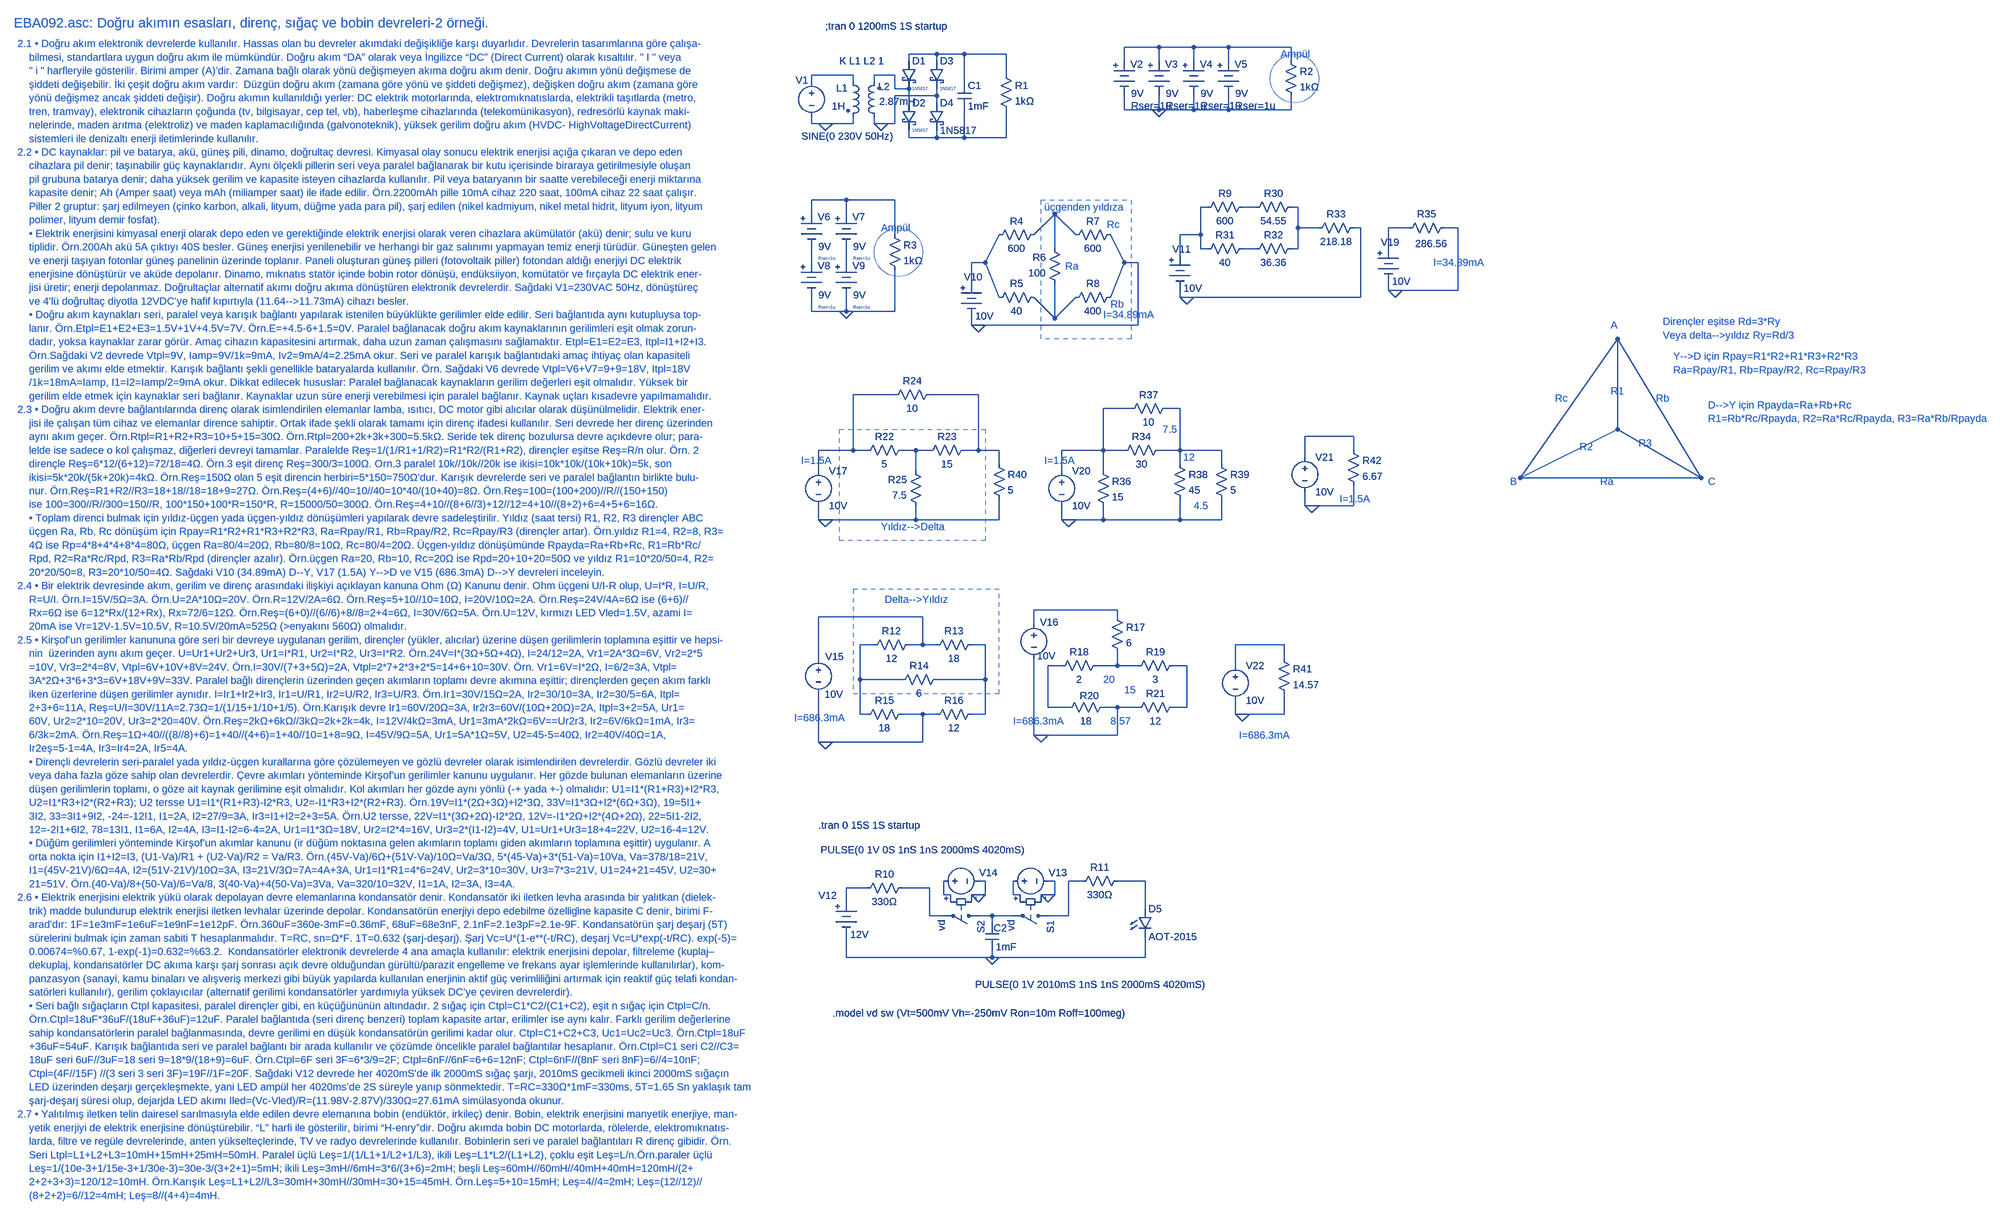
[diagram p0: schematic EBA092.asc]
EBA092.asc, the LTspice schematic file:
Version 4
SHEET 1 5628 4108
WIRE 2768 96 2688 96
WIRE 2848 96 2768 96
WIRE 2928 96 2848 96
WIRE 3072 96 2928 96
WIRE 2256 112 2192 112
WIRE 2320 112 2256 112
WIRE 2416 112 2320 112
WIRE 2192 128 2192 112
WIRE 2256 128 2256 112
WIRE 2688 128 2688 96
WIRE 2768 128 2768 96
WIRE 2848 128 2848 96
WIRE 2928 128 2928 96
WIRE 3072 128 3072 96
WIRE 2064 160 1968 160
WIRE 2160 160 2112 160
WIRE 2416 160 2416 112
WIRE 1968 176 1968 160
WIRE 2064 176 2064 160
WIRE 2112 176 2112 160
WIRE 2320 176 2320 112
WIRE 2160 192 2160 160
WIRE 2192 192 2160 192
WIRE 2256 208 2256 192
WIRE 2256 208 2160 208
WIRE 2192 224 2192 192
WIRE 2256 224 2256 208
WIRE 2688 240 2688 208
WIRE 2768 240 2768 208
WIRE 2768 240 2688 240
WIRE 2848 240 2848 208
WIRE 2848 240 2768 240
WIRE 2928 240 2928 208
WIRE 2928 240 2848 240
WIRE 3072 240 3072 208
WIRE 3072 240 2928 240
WIRE 1968 272 1968 256
WIRE 2000 272 1968 272
WIRE 2064 272 2064 256
WIRE 2064 272 2000 272
WIRE 2112 272 2112 256
WIRE 2128 272 2112 272
WIRE 2160 272 2160 208
WIRE 2160 272 2128 272
WIRE 2192 304 2192 288
WIRE 2256 304 2256 288
WIRE 2256 304 2192 304
WIRE 2320 304 2320 240
WIRE 2320 304 2256 304
WIRE 2416 304 2416 240
WIRE 2416 304 2320 304
WIRE 2048 448 1968 448
WIRE 2160 448 2048 448
WIRE 2880 464 2864 464
WIRE 2992 464 2960 464
WIRE 3088 464 3072 464
WIRE 1968 480 1968 448
WIRE 2048 480 2048 448
WIRE 3088 512 3088 464
WIRE 3136 512 3088 512
WIRE 3232 512 3216 512
WIRE 3344 512 3296 512
WIRE 3456 512 3424 512
WIRE 2160 528 2160 448
WIRE 2480 528 2528 480
WIRE 2576 528 2528 480
WIRE 2864 528 2864 464
WIRE 2864 528 2816 528
WIRE 2528 560 2528 480
WIRE 2864 560 2864 528
WIRE 2880 560 2864 560
WIRE 2992 560 2960 560
WIRE 3088 560 3088 512
WIRE 3088 560 3072 560
WIRE 3296 560 3296 512
WIRE 2816 576 2816 528
WIRE 1968 592 1968 560
WIRE 2048 592 2048 560
WIRE 2368 592 2400 528
WIRE 2368 592 2336 592
WIRE 2688 592 2656 528
WIRE 2720 592 2688 592
WIRE 2336 640 2336 592
WIRE 3296 656 3296 640
WIRE 3312 656 3296 656
WIRE 3456 656 3456 512
WIRE 3456 656 3312 656
WIRE 2400 672 2368 592
WIRE 2656 672 2688 592
WIRE 2816 672 2816 656
WIRE 2832 672 2816 672
WIRE 3232 672 3232 512
WIRE 3232 672 2832 672
WIRE 1968 704 1968 672
WIRE 2048 704 2048 672
WIRE 2048 704 1968 704
WIRE 2160 704 2160 608
WIRE 2160 704 2048 704
WIRE 2528 720 2528 640
WIRE 2528 720 2480 672
WIRE 2528 720 2576 672
WIRE 2336 736 2336 720
WIRE 2352 736 2336 736
WIRE 2720 736 2720 592
WIRE 2720 736 2352 736
WIRE 2160 896 2064 896
WIRE 2352 896 2240 896
WIRE 2704 928 2640 928
WIRE 2816 928 2784 928
WIRE 3824 976 3824 768
WIRE 3216 992 3104 992
WIRE 2064 1024 2064 896
WIRE 2064 1024 1984 1024
WIRE 2096 1024 2064 1024
WIRE 2208 1024 2176 1024
WIRE 2240 1024 2208 1024
WIRE 2352 1024 2352 896
WIRE 2352 1024 2320 1024
WIRE 2400 1024 2352 1024
WIRE 2640 1024 2640 928
WIRE 2640 1024 2544 1024
WIRE 2688 1024 2640 1024
WIRE 2816 1024 2816 928
WIRE 2816 1024 2768 1024
WIRE 2912 1024 2816 1024
WIRE 3216 1024 3216 992
WIRE 3104 1040 3104 992
WIRE 2400 1056 2400 1024
WIRE 2816 1056 2816 1024
WIRE 2912 1056 2912 1024
WIRE 1984 1072 1984 1024
WIRE 2208 1072 2208 1024
WIRE 2544 1072 2544 1024
WIRE 2640 1072 2640 1024
WIRE 3600 1088 3824 768
WIRE 3600 1088 3824 976
WIRE 4016 1088 3824 768
WIRE 4016 1088 3824 976
WIRE 4016 1088 3600 1088
WIRE 3104 1152 3104 1120
WIRE 3120 1152 3104 1152
WIRE 3216 1152 3216 1104
WIRE 3216 1152 3120 1152
WIRE 1984 1184 1984 1152
WIRE 2000 1184 1984 1184
WIRE 2208 1184 2208 1152
WIRE 2208 1184 2000 1184
WIRE 2400 1184 2400 1136
WIRE 2400 1184 2208 1184
WIRE 2544 1184 2544 1152
WIRE 2560 1184 2544 1184
WIRE 2640 1184 2640 1152
WIRE 2640 1184 2560 1184
WIRE 2816 1184 2816 1136
WIRE 2816 1184 2640 1184
WIRE 2912 1184 2912 1136
WIRE 2912 1184 2816 1184
WIRE 2672 1392 2480 1392
WIRE 2224 1408 1984 1408
WIRE 2672 1408 2672 1392
WIRE 2480 1424 2480 1392
WIRE 2112 1472 2080 1472
WIRE 2224 1472 2224 1408
WIRE 2224 1472 2192 1472
WIRE 2256 1472 2224 1472
WIRE 2368 1472 2336 1472
WIRE 3056 1472 2944 1472
WIRE 1984 1504 1984 1408
WIRE 3056 1504 3056 1472
WIRE 2544 1520 2512 1520
WIRE 2672 1520 2672 1488
WIRE 2672 1520 2624 1520
WIRE 2720 1520 2672 1520
WIRE 2832 1520 2800 1520
WIRE 2944 1520 2944 1472
WIRE 2080 1552 2080 1472
WIRE 2176 1552 2080 1552
WIRE 2368 1552 2368 1472
WIRE 2368 1552 2256 1552
WIRE 2512 1616 2512 1520
WIRE 2560 1616 2512 1616
WIRE 2672 1616 2640 1616
WIRE 2720 1616 2672 1616
WIRE 2832 1616 2832 1520
WIRE 2832 1616 2800 1616
WIRE 2080 1632 2080 1552
WIRE 2096 1632 2080 1632
WIRE 2224 1632 2176 1632
WIRE 2256 1632 2224 1632
WIRE 2368 1632 2368 1552
WIRE 2368 1632 2336 1632
WIRE 2944 1632 2944 1600
WIRE 2960 1632 2944 1632
WIRE 3056 1632 3056 1584
WIRE 3056 1632 2960 1632
WIRE 2480 1680 2480 1504
WIRE 2496 1680 2480 1680
WIRE 2672 1680 2672 1616
WIRE 2672 1680 2496 1680
WIRE 1984 1696 1984 1584
WIRE 2000 1696 1984 1696
WIRE 2224 1696 2224 1632
WIRE 2224 1696 2000 1696
WIRE 2368 2016 2352 2016
WIRE 2528 2016 2512 2016
WIRE 2592 2016 2560 2016
WIRE 2736 2016 2672 2016
WIRE 2096 2032 2048 2032
WIRE 2240 2032 2176 2032
WIRE 2272 2048 2272 2016
WIRE 2288 2048 2272 2048
WIRE 2352 2048 2336 2048
WIRE 2368 2048 2368 2016
WIRE 2368 2048 2352 2048
WIRE 2432 2048 2432 2016
WIRE 2448 2048 2432 2048
WIRE 2512 2048 2496 2048
WIRE 2528 2048 2528 2016
WIRE 2528 2048 2512 2048
WIRE 2048 2064 2048 2032
WIRE 2736 2080 2736 2016
WIRE 2240 2096 2240 2032
WIRE 2272 2096 2240 2096
WIRE 2384 2096 2352 2096
WIRE 2432 2096 2384 2096
WIRE 2560 2096 2560 2016
WIRE 2560 2096 2512 2096
WIRE 2384 2112 2384 2096
WIRE 2048 2192 2048 2144
WIRE 2384 2192 2384 2176
WIRE 2384 2192 2048 2192
WIRE 2736 2192 2736 2144
WIRE 2736 2192 2384 2192
FLAG 2128 272 0
FLAG 2000 272 0
FLAG 2768 240 0
FLAG 2048 704 0
FLAG 2352 736 0
FLAG 2832 672 0
FLAG 2384 2192 0
FLAG 2512 2048 0
FLAG 2352 2048 0
FLAG 2000 1696 0
FLAG 2496 1680 0
FLAG 2000 1184 0
FLAG 3312 656 0
FLAG 2560 1184 0
FLAG 3120 1152 0
FLAG 2960 1632 0
SYMBOL voltage 1968 160 R0
WINDOW 0 -37 12 Left 2
WINDOW 3 -23 141 Left 2
WINDOW 123 0 0 Left 0
WINDOW 39 0 0 Left 0
SYMATTR InstName V1
SYMATTR Value SINE(0 230V 50Hz)
SYMBOL ind2 2048 160 R0
WINDOW 0 -23 30 Left 2
WINDOW 3 -33 72 Left 2
SYMATTR InstName L1
SYMATTR Value 1H
SYMATTR Type ind
SYMATTR SpiceLine Rser=10Ω
SYMBOL ind2 2128 272 R180
WINDOW 0 -20 85 Left 2
WINDOW 3 -81 51 Left 2
SYMATTR InstName L2
SYMATTR Value 2.87mH
SYMATTR Type ind
SYMBOL schottky 2176 128 R0
WINDOW 3 24 64 Left 0
SYMATTR Value 1N5817
SYMATTR InstName D1
SYMATTR Description Diode
SYMATTR Type diode
SYMBOL schottky 2176 224 R0
WINDOW 3 24 64 Left 0
SYMATTR Value 1N5817
SYMATTR InstName D2
SYMATTR Description Diode
SYMATTR Type diode
SYMBOL schottky 2240 128 R0
WINDOW 3 24 64 Left 0
SYMATTR Value 1N5817
SYMATTR InstName D3
SYMATTR Description Diode
SYMATTR Type diode
SYMBOL schottky 2240 224 R0
SYMATTR InstName D4
SYMATTR Value 1N5817
SYMATTR Description Diode
SYMATTR Type diode
SYMBOL cap 2304 176 R0
SYMATTR InstName C1
SYMATTR Value 1mF
SYMBOL res 2400 144 R0
SYMATTR InstName R1
SYMATTR Value 1kΩ
SYMBOL Misc\\battery 2688 112 R0
WINDOW 0 14 23 Left 2
WINDOW 3 16 91 Left 2
WINDOW 123 0 0 Left 0
WINDOW 39 16 119 Left 2
SYMATTR InstName V2
SYMATTR Value 9V
SYMATTR SpiceLine Rser=1u
SYMBOL Misc\\battery 2768 112 R0
WINDOW 0 14 23 Left 2
WINDOW 3 16 91 Left 2
WINDOW 123 0 0 Left 0
WINDOW 39 16 119 Left 2
SYMATTR InstName V3
SYMATTR Value 9V
SYMATTR SpiceLine Rser=1u
SYMBOL Misc\\battery 2848 112 R0
WINDOW 0 14 23 Left 2
WINDOW 3 16 91 Left 2
WINDOW 123 0 0 Left 0
WINDOW 39 16 119 Left 2
SYMATTR InstName V4
SYMATTR Value 9V
SYMATTR SpiceLine Rser=1u
SYMBOL Misc\\battery 2928 112 R0
WINDOW 0 14 23 Left 2
WINDOW 3 16 91 Left 2
WINDOW 123 0 0 Left 0
WINDOW 39 16 119 Left 2
SYMATTR InstName V5
SYMATTR Value 9V
SYMATTR SpiceLine Rser=1u
SYMBOL res 3056 112 R0
SYMATTR InstName R2
SYMATTR Value 1kΩ
SYMBOL Misc\\battery 1968 464 R0
WINDOW 0 14 23 Left 2
WINDOW 3 16 91 Left 2
WINDOW 123 0 0 Left 0
WINDOW 39 16 119 Left 0
SYMATTR InstName V6
SYMATTR Value 9V
SYMATTR SpiceLine Rser=1u
SYMBOL Misc\\battery 2048 464 R0
WINDOW 0 14 23 Left 2
WINDOW 3 16 91 Left 2
WINDOW 123 0 0 Left 0
WINDOW 39 16 119 Left 0
SYMATTR InstName V7
SYMATTR Value 9V
SYMATTR SpiceLine Rser=1u
SYMBOL Misc\\battery 1968 576 R0
WINDOW 0 14 23 Left 2
WINDOW 3 16 91 Left 2
WINDOW 123 0 0 Left 0
WINDOW 39 16 119 Left 0
SYMATTR InstName V8
SYMATTR Value 9V
SYMATTR SpiceLine Rser=1u
SYMBOL Misc\\battery 2048 576 R0
WINDOW 0 14 23 Left 2
WINDOW 3 16 91 Left 2
WINDOW 123 0 0 Left 0
WINDOW 39 16 119 Left 0
SYMATTR InstName V9
SYMATTR Value 9V
SYMATTR SpiceLine Rser=1u
SYMBOL res 2144 512 R0
SYMATTR InstName R3
SYMATTR Value 1kΩ
SYMBOL res 2496 512 R90
WINDOW 0 0 56 VBottom 2
WINDOW 3 32 56 VTop 2
SYMATTR InstName R4
SYMATTR Value 600
SYMBOL res 2496 656 R90
WINDOW 0 0 56 VBottom 2
WINDOW 3 32 56 VTop 2
SYMATTR InstName R5
SYMATTR Value 40
SYMBOL res 2544 656 R180
WINDOW 0 36 76 Left 2
WINDOW 3 36 40 Left 2
SYMATTR InstName R6
SYMATTR Value 100
SYMBOL res 2672 512 R90
WINDOW 0 0 56 VBottom 2
WINDOW 3 32 56 VTop 2
SYMATTR InstName R7
SYMATTR Value 600
SYMBOL res 2672 656 R90
WINDOW 0 0 56 VBottom 2
WINDOW 3 32 56 VTop 2
SYMATTR InstName R8
SYMATTR Value 400
SYMBOL Misc\\battery 2336 624 R0
WINDOW 0 -17 1 Left 2
WINDOW 3 9 91 Left 2
WINDOW 123 0 0 Left 0
WINDOW 39 16 119 Left 2
SYMATTR InstName V10
SYMATTR Value 10V
SYMBOL Misc\\battery 2816 560 R0
WINDOW 0 -17 1 Left 2
WINDOW 3 9 91 Left 2
WINDOW 123 0 0 Left 0
WINDOW 39 16 119 Left 2
SYMATTR InstName V11
SYMATTR Value 10V
SYMBOL Misc\\battery 2048 2048 R0
WINDOW 0 -64 1 Left 2
WINDOW 3 9 91 Left 2
WINDOW 123 0 0 Left 0
WINDOW 39 16 119 Left 2
SYMATTR InstName V12
SYMATTR Value 12V
SYMBOL res 2192 2016 R90
WINDOW 0 0 56 VBottom 2
WINDOW 3 32 56 VTop 2
SYMATTR InstName R10
SYMATTR Value 330Ω
SYMBOL cap 2368 2112 R0
WINDOW 0 19 12 Left 2
SYMATTR InstName C2
SYMATTR Value 1mF
SYMBOL res 2688 2000 R90
WINDOW 0 0 56 VBottom 2
WINDOW 3 32 56 VTop 2
SYMATTR InstName R11
SYMATTR Value 330Ω
SYMBOL LED 2720 2080 R0
SYMATTR InstName D5
SYMATTR Value AOT-2015
SYMATTR Description Diode
SYMATTR Type diode
SYMBOL sw 2528 2096 R90
WINDOW 0 11 9 Left 2
WINDOW 3 10 100 Left 2
SYMATTR InstName S1
SYMATTR Value vd
SYMBOL voltage 2416 2016 R270
WINDOW 0 19 98 VRight 2
WINDOW 3 -238 -71 VRight 2
WINDOW 123 0 0 Left 0
WINDOW 39 0 0 Left 0
SYMATTR InstName V13
SYMATTR Value PULSE(0 1V 2010mS 1nS 1nS 2000mS 4020mS)
SYMBOL sw 2368 2096 R90
WINDOW 0 11 9 Left 2
WINDOW 3 10 100 Left 2
SYMATTR InstName S2
SYMATTR Value vd
SYMBOL voltage 2256 2016 R270
WINDOW 0 19 98 VRight 2
WINDOW 3 72 -267 VRight 2
WINDOW 123 0 0 Left 0
WINDOW 39 0 0 Left 0
SYMATTR InstName V14
SYMATTR Value PULSE(0 1V 0S 1nS 1nS 2000mS 4020mS)
SYMBOL voltage 1984 1488 R0
WINDOW 0 16 11 Left 2
WINDOW 3 14 98 Left 2
SYMATTR InstName V15
SYMATTR Value 10V
SYMBOL res 2208 1456 R90
WINDOW 0 0 56 VBottom 2
WINDOW 3 32 56 VTop 2
SYMATTR InstName R12
SYMATTR Value 12
SYMBOL res 2352 1456 R90
WINDOW 0 0 56 VBottom 2
WINDOW 3 32 56 VTop 2
SYMATTR InstName R13
SYMATTR Value 18
SYMBOL res 2272 1536 R90
WINDOW 0 0 56 VBottom 2
WINDOW 3 32 56 VTop 2
SYMATTR InstName R14
SYMATTR Value 6
SYMBOL res 2192 1616 R90
WINDOW 0 0 56 VBottom 2
WINDOW 3 32 56 VTop 2
SYMATTR InstName R15
SYMATTR Value 18
SYMBOL res 2352 1616 R90
WINDOW 0 0 56 VBottom 2
WINDOW 3 32 56 VTop 2
SYMATTR InstName R16
SYMATTR Value 12
SYMBOL voltage 2480 1408 R0
WINDOW 0 14 12 Left 2
WINDOW 3 7 90 Left 2
SYMATTR InstName V16
SYMATTR Value 10V
SYMBOL res 2656 1392 R0
SYMATTR InstName R17
SYMATTR Value 6
SYMBOL res 2640 1504 R90
WINDOW 0 0 56 VBottom 2
WINDOW 3 32 56 VTop 2
SYMATTR InstName R18
SYMATTR Value 2
SYMBOL res 2816 1504 R90
WINDOW 0 0 56 VBottom 2
WINDOW 3 32 56 VTop 2
SYMATTR InstName R19
SYMATTR Value 3
SYMBOL res 2656 1600 R90
WINDOW 0 5 48 VBottom 2
WINDOW 3 32 56 VTop 2
SYMATTR InstName R20
SYMATTR Value 18
SYMBOL res 2816 1600 R90
WINDOW 0 0 56 VBottom 2
WINDOW 3 32 56 VTop 2
SYMATTR InstName R21
SYMATTR Value 12
SYMBOL voltage 1984 1056 R0
SYMATTR InstName V17
SYMATTR Value 10V
SYMBOL res 2192 1008 R90
WINDOW 0 0 56 VBottom 2
WINDOW 3 32 56 VTop 2
SYMATTR InstName R22
SYMATTR Value 5
SYMBOL res 2336 1008 R90
WINDOW 0 0 56 VBottom 2
WINDOW 3 32 56 VTop 2
SYMATTR InstName R23
SYMATTR Value 15
SYMBOL res 2256 880 R90
WINDOW 0 0 56 VBottom 2
WINDOW 3 32 56 VTop 2
SYMATTR InstName R24
SYMATTR Value 10
SYMBOL res 2224 1168 R180
WINDOW 0 36 76 Left 2
WINDOW 3 36 40 Left 2
SYMATTR InstName R25
SYMATTR Value 7.5
SYMBOL res 2976 448 R90
WINDOW 0 0 56 VBottom 2
WINDOW 3 32 56 VTop 2
SYMATTR InstName R9
SYMATTR Value 600
SYMBOL res 3088 448 R90
WINDOW 0 0 56 VBottom 2
WINDOW 3 32 56 VTop 2
SYMATTR InstName R30
SYMATTR Value 54.55
SYMBOL res 2976 544 R90
WINDOW 0 0 56 VBottom 2
WINDOW 3 32 56 VTop 2
SYMATTR InstName R31
SYMATTR Value 40
SYMBOL res 3088 544 R90
WINDOW 0 0 56 VBottom 2
WINDOW 3 32 56 VTop 2
SYMATTR InstName R32
SYMATTR Value 36.36
SYMBOL res 3232 496 R90
WINDOW 0 0 56 VBottom 2
WINDOW 3 32 56 VTop 2
SYMATTR InstName R33
SYMATTR Value 218.18
SYMBOL Misc\\battery 3296 544 R0
WINDOW 0 -17 1 Left 2
WINDOW 3 9 91 Left 2
WINDOW 123 0 0 Left 0
WINDOW 39 16 119 Left 2
SYMATTR InstName V19
SYMATTR Value 10V
SYMBOL res 3440 496 R90
WINDOW 0 0 56 VBottom 2
WINDOW 3 37 45 VTop 2
SYMATTR InstName R35
SYMATTR Value 286.56
SYMBOL voltage 2544 1056 R0
SYMATTR InstName V20
SYMATTR Value 10V
SYMBOL res 2800 912 R90
WINDOW 0 0 56 VBottom 2
WINDOW 3 32 56 VTop 2
SYMATTR InstName R37
SYMATTR Value 10
SYMBOL res 2896 1040 R0
SYMATTR InstName R39
SYMATTR Value 5
SYMBOL res 2384 1040 R0
SYMATTR InstName R40
SYMATTR Value 5
SYMBOL res 2784 1008 R90
WINDOW 0 0 56 VBottom 2
WINDOW 3 32 56 VTop 2
SYMATTR InstName R34
SYMATTR Value 30
SYMBOL res 2624 1056 R0
SYMATTR InstName R36
SYMATTR Value 15
SYMBOL res 2800 1040 R0
SYMATTR InstName R38
SYMATTR Value 45
SYMBOL voltage 3104 1024 R0
SYMATTR InstName V21
SYMATTR Value 10V
SYMBOL res 3200 1008 R0
SYMATTR InstName R42
SYMATTR Value 6.67
SYMBOL voltage 2944 1504 R0
SYMATTR InstName V22
SYMATTR Value 10V
SYMBOL res 3040 1488 R0
SYMATTR InstName R41
SYMATTR Value 14.57
TEXT -152 40 Left 3 ;EBA092.asc: Doğru akımın esasları, direnç, sığaç ve bobin devreleri-2 örneği.
TEXT -144 88 Left 2 ;2.1 • Doğru akım elektronik devrelerde kullanılır. Hassas olan bu devreler akımdaki değişikliğe karşı duyarlıdır. Devrelerin tasarımlarına göre çalışa-\n    bilmesi, standartlara uygun doğru akım ile mümkündür. Doğru akım “DA” olarak veya İngilizce “DC” (Direct Current) olarak kısaltılır. " I " veya \n    " i " harfleryile gösterilir. Birimi amper (A)’dir. Zamana bağlı olarak yönü değişmeyen akıma doğru akım denir. Doğru akımın yönü değişmese de\n    şiddeti değişebilir. İki çeşit doğru akım vardır:  Düzgün doğru akım (zamana göre yönü ve şiddeti değişmez), değişken doğru akım (zamana göre\n    yönü değişmez ancak şiddeti değişir). Doğru akımın kullanıldığı yerler: DC elektrik motorlarında, elektromıknatıslarda, elektrikli taşıtlarda (metro, \n    tren, tramvay), elektronik cihazların çoğunda (tv, bilgisayar, cep tel, vb), haberleşme cihazlarında (telekomünikasyon), redresörlü kaynak maki-\n    nelerinde, maden arıtma (elektroliz) ve maden kaplamacılığında (galvonoteknik), yüksek gerilim doğru akım (HVDC- HighVoltageDirectCurrent) \n    sistemleri ile denizaltı enerji iletimlerinde kullanılır.\n2.2 • DC kaynaklar: pil ve batarya, akü, güneş pili, dinamo, doğrultaç devresi. Kimyasal olay sonucu elektrik enerjisi açığa çıkaran ve depo eden\n    cihazlara pil denir; taşınabilir güç kaynaklarıdır. Aynı ölçekli pillerin seri veya paralel bağlanarak bir kutu içerisinde biraraya getirilmesiyle oluşan \n    pil grubuna batarya denir; daha yüksek gerilim ve kapasite isteyen cihazlarda kullanılır. Pil veya bataryanın bir saatte verebileceği enerji miktarına\n    kapasite denir; Ah (Amper saat) veya mAh (miliamper saat) ile ifade edilir. Örn.2200mAh pille 10mA cihaz 220 saat, 100mA cihaz 22 saat çalışır.\n    Piller 2 gruptur: şarj edilmeyen (çinko karbon, alkali, lityum, düğme yada para pil), şarj edilen (nikel kadmiyum, nikel metal hidrit, lityum iyon, lityum\n    polimer, lityum demir fosfat).\n    • Elektrik enerjisini kimyasal enerji olarak depo eden ve gerektiğinde elektrik enerjisi olarak veren cihazlara akümülatör (akü) denir; sulu ve kuru\n    tiplidir. Örn.200Ah akü 5A çıktıyı 40S besler. Güneş enerjisi yenilenebilir ve herhangi bir gaz salınımı yapmayan temiz enerji türüdür. Güneşten gelen\n    ve enerji taşıyan fotonlar güneş panelinin üzerinde toplanır. Paneli oluşturan güneş pilleri (fotovoltaik piller) fotondan aldığı enerjiyi DC elektrik\n    enerjisine dönüştürür ve aküde depolanır. Dinamo, mıknatıs statör içinde bobin rotor dönüşü, endüksiiyon, komütatör ve fırçayla DC elektrik ener-\n    jisi üretir; enerji depolanmaz. Doğrultaçlar alternatif akımı doğru akıma dönüştüren elektronik devrelerdir. Sağdaki V1=230VAC 50Hz, dönüştüreç\n    ve 4'lü doğrultaç diyotla 12VDC'ye hafif kıpırtıyla (11.64-->11.73mA) cihazı besler.\n    • Doğru akım kaynakları seri, paralel veya karışık bağlantı yapılarak istenilen büyüklükte gerilimler elde edilir. Seri bağlantıda aynı kutupluysa top-\n    lanır. Örn.Etpl=E1+E2+E3=1.5V+1V+4.5V=7V. Örn.E=+4.5-6+1.5=0V. Paralel bağlanacak doğru akım kaynaklarının gerilimleri eşit olmak zorun-\n    dadır, yoksa kaynaklar zarar görür. Amaç cihazın kapasitesini artırmak, daha uzun zaman çalışmasını sağlamaktır. Etpl=E1=E2=E3, Itpl=I1+I2+I3.\n    Örn.Sağdaki V2 devrede Vtpl=9V, Iamp=9V/1k=9mA, Iv2=9mA/4=2.25mA okur. Seri ve paralel karışık bağlantıdaki amaç ihtiyaç olan kapasiteli\n    gerilim ve akımı elde etmektir. Karışık bağlantı şekli genellikle bataryalarda kullanılır. Örn. Sağdaki V6 devrede Vtpl=V6+V7=9+9=18V, Itpl=18V\n    /1k=18mA=Iamp, I1=I2=Iamp/2=9mA okur. Dikkat edilecek hususlar: Paralel bağlanacak kaynakların gerilim değerleri eşit olmalıdır. Yüksek bir \n    gerilim elde etmek için kaynaklar seri bağlanır. Kaynaklar uzun süre enerji verebilmesi için paralel bağlanır. Kaynak uçları kısadevre yapılmamalıdır.\n2.3 • Doğru akım devre bağlantılarında direnç olarak isimlendirilen elemanlar lamba, ısıtıcı, DC motor gibi alıcılar olarak düşünülmelidir. Elektrik ener-\n    jisi ile çalışan tüm cihaz ve elemanlar dirence sahiptir. Ortak ifade şekli olarak tamamı için direnç ifadesi kullanılır. Seri devrede her direnç üzerinden\n    aynı akım geçer. Örn.Rtpl=R1+R2+R3=10+5+15=30Ω. Örn.Rtpl=200+2k+3k+300=5.5kΩ. Seride tek direnç bozulursa devre açıkdevre olur; para-\n    lelde ise sadece o kol çalışmaz, diğerleri devreyi tamamlar. Paralelde Reş=1/(1/R1+1/R2)=R1*R2/(R1+R2), dirençler eşitse Reş=R/n olur. Örn. 2 \n    dirençle Reş=6*12/(6+12)=72/18=4Ω. Örn.3 eşit direnç Reş=300/3=100Ω. Orn.3 paralel 10k//10k//20k ise ikisi=10k*10k/(10k+10k)=5k, son\n    ikisi=5k*20k/(5k+20k)=4kΩ. Örn.Reş=150Ω olan 5 eşit direncin herbiri=5*150=750Ω'dur. Karışık devrelerde seri ve paralel bağlantın birlikte bulu-\n    nur. Örn.Reş=R1+R2//R3=18+18//18=18+9=27Ω. Örn.Reş=(4+6)//40=10//40=10*40/(10+40)=8Ω. Örn.Reş=100=(100+200)//R//(150+150)\n    ise 100=300//R//300=150//R, 100*150+100*R=150*R, R=15000/50=300Ω. Örn.Reş=4+10//(8+6//3)+12//12=4+10//(8+2)+6=4+5+6=16Ω.\n    • Toplam direnci bulmak için yıldız-üçgen yada üçgen-yıldız dönüşümleri yapılarak devre sadeleştirilir. Yıldız (saat tersi) R1, R2, R3 dirençler ABC \n    üçgen Ra, Rb, Rc dönüşüm için Rpay=R1*R2+R1*R3+R2*R3, Ra=Rpay/R1, Rb=Rpay/R2, Rc=Rpay/R3 (dirençler artar). Örn.yıldız R1=4, R2=8, R3=\n    4Ω ise Rp=4*8+4*4+8*4=80Ω, üçgen Ra=80/4=20Ω, Rb=80/8=10Ω, Rc=80/4=20Ω. Üçgen-yıldız dönüşümünde Rpayda=Ra+Rb+Rc, R1=Rb*Rc/\n    Rpd, R2=Ra*Rc/Rpd, R3=Ra*Rb/Rpd (dirençler azalır). Örn.üçgen Ra=20, Rb=10, Rc=20Ω ise Rpd=20+10+20=50Ω ve yıldız R1=10*20/50=4, R2=\n    20*20/50=8, R3=20*10/50=4Ω. Sağdaki V10 (34.89mA) D--Y, V17 (1.5A) Y-->D ve V15 (686.3mA) D-->Y devreleri inceleyin.\n2.4 • Bir elektrik devresinde akım, gerilim ve direnç arasındaki ilişkiyi açıklayan kanuna Ohm (Ω) Kanunu denir. Ohm üçgeni U/I-R olup, U=I*R, I=U/R,\n    R=U/I. Örn.I=15V/5Ω=3A. Örn.U=2A*10Ω=20V. Örn.R=12V/2A=6Ω. Örn.Reş=5+10//10=10Ω, I=20V/10Ω=2A. Örn.Reş=24V/4A=6Ω ise (6+6)//\n    Rx=6Ω ise 6=12*Rx/(12+Rx), Rx=72/6=12Ω. Örn.Reş=(6+0)//(6//6)+8//8=2+4=6Ω, I=30V/6Ω=5A. Örn.U=12V, kırmızı LED Vled=1.5V, azami I=\n    20mA ise Vr=12V-1.5V=10.5V, R=10.5V/20mA=525Ω (>enyakını 560Ω) olmalıdır.\n2.5 • Kirşof'un gerilimler kanununa göre seri bir devreye uygulanan gerilim, dirençler (yükler, alıcılar) üzerine düşen gerilimlerin toplamına eşittir ve hepsi-\n    nin  üzerinden aynı akım geçer. U=Ur1+Ur2+Ur3, Ur1=I*R1, Ur2=I*R2, Ur3=I*R2. Örn.24V=I*(3Ω+5Ω+4Ω), I=24/12=2A, Vr1=2A*3Ω=6V, Vr2=2*5\n    =10V, Vr3=2*4=8V, Vtpl=6V+10V+8V=24V. Örn.I=30V/(7+3+5Ω)=2A, Vtpl=2*7+2*3+2*5=14+6+10=30V. Örn. Vr1=6V=I*2Ω, I=6/2=3A, Vtpl=\n    3A*2Ω+3*6+3*3=6V+18V+9V=33V. Paralel bağlı dirençlerin üzerinden geçen akımların toplamı devre akımına eşittir; dirençlerden geçen akım farklı\n    iken üzerlerine düşen gerilimler aynıdır. I=Ir1+Ir2+Ir3, Ir1=U/R1, Ir2=U/R2, Ir3=U/R3. Örn.Ir1=30V/15Ω=2A, Ir2=30/10=3A, Ir2=30/5=6A, Itpl=\n    2+3+6=11A, Reş=U/I=30V/11A=2.73Ω=1/(1/15+1/10+1/5). Örn.Karışık devre Ir1=60V/20Ω=3A, Ir2r3=60V/(10Ω+20Ω)=2A, Itpl=3+2=5A, Ur1=\n    60V, Ur2=2*10=20V, Ur3=2*20=40V. Örn.Reş=2kΩ+6kΩ//3kΩ=2k+2k=4k, I=12V/4kΩ=3mA, Ur1=3mA*2kΩ=6V==Ur2r3, Ir2=6V/6kΩ=1mA, Ir3=\n    6/3k=2mA. Örn.Reş=1Ω+40//((8//8)+6)=1+40//(4+6)=1+40//10=1+8=9Ω, I=45V/9Ω=5A, Ur1=5A*1Ω=5V, U2=45-5=40Ω, Ir2=40V/40Ω=1A, \n    Ir2eş=5-1=4A, Ir3=Ir4=2A, Ir5=4A.\n    • Dirençli devrelerin seri-paralel yada yıldız-üçgen kurallarına göre çözülemeyen ve gözlü devreler olarak isimlendirilen devrelerdir. Gözlü devreler iki \n    veya daha fazla göze sahip olan devrelerdir. Çevre akımları yönteminde Kirşof’un gerilimler kanunu uygulanır. Her gözde bulunan elemanların üzerine\n    düşen gerilimlerin toplamı, o göze ait kaynak gerilimine eşit olmalıdır. Kol akımları her gözde aynı yönlü (-+ yada +-) olmalıdır: U1=I1*(R1+R3)+I2*R3, \n    U2=I1*R3+I2*(R2+R3); U2 tersse U1=I1*(R1+R3)-I2*R3, U2=-I1*R3+I2*(R2+R3). Örn.19V=I1*(2Ω+3Ω)+I2*3Ω, 33V=I1*3Ω+I2*(6Ω+3Ω), 19=5I1+\n    3I2, 33=3I1+9I2, -24=-12I1, I1=2A, I2=27/9=3A, Ir3=I1+I2=2+3=5A. Örn.U2 tersse, 22V=I1*(3Ω+2Ω)-I2*2Ω, 12V=-I1*2Ω+I2*(4Ω+2Ω), 22=5I1-2I2,\n    12=-2I1+6I2, 78=13I1, I1=6A, I2=4A, I3=I1-I2=6-4=2A, Ur1=I1*3Ω=18V, Ur2=I2*4=16V, Ur3=2*(I1-I2)=4V, U1=Ur1+Ur3=18+4=22V, U2=16-4=12V.\n    • Düğüm gerilimleri yönteminde Kirşof’un akımlar kanunu (ir düğüm noktasına gelen akımların toplamı giden akımların toplamına eşittir) uygulanır. A\n    orta nokta için I1+I2=I3, (U1-Va)/R1 + (U2-Va)/R2 = Va/R3. Örn.(45V-Va)/6Ω+(51V-Va)/10Ω=Va/3Ω, 5*(45-Va)+3*(51-Va)=10Va, Va=378/18=21V,\n    I1=(45V-21V)/6Ω=4A, I2=(51V-21V)/10Ω=3A, I3=21V/3Ω=7A=4A+3A, Ur1=I1*R1=4*6=24V, Ur2=3*10=30V, Ur3=7*3=21V, U1=24+21=45V, U2=30+\n    21=51V. Örn.(40-Va)/8+(50-Va)/6=Va/8, 3(40-Va)+4(50-Va)=3Va, Va=320/10=32V, I1=1A, I2=3A, I3=4A.\n2.6 • Elektrik enerjisini elektrik yükü olarak depolayan devre elemanlarına kondansatör denir. Kondansatör iki iletken levha arasında bir yalıtkan (dielek-\n    trik) madde bulundurup elektrik enerjisi iletken levhalar üzerinde depolar. Kondansatörün enerjiyi depo edebilme özelliğine kapasite C denir, birimi F-\n    arad'dır: 1F=1e3mF=1e6uF=1e9nF=1e12pF. Örn.360uF=360e-3mF=0.36mF, 68uF=68e3nF, 2.1nF=2.1e3pF=2.1e-9F. Kondansatörün şarj deşarj (5T)\n    sürelerini bulmak için zaman sabiti T hesaplanmalıdır. T=RC, sn=Ω*F. 1T=0.632 (şarj-deşarj). Şarj Vc=U*(1-e**(-t/RC), deşarj Vc=U*exp(-t/RC). exp(-5)=\n    0.00674=%0.67, 1-exp(-1)=0.632=%63.2.  Kondansatörler elektronik devrelerde 4 ana amaçla kullanılır: elektrik enerjisini depolar, filtreleme (kuplaj–\n    dekuplaj, kondansatörler DC akıma karşı şarj sonrası açık devre olduğundan gürültü/parazit engelleme ve frekans ayar işlemlerinde kullanılırlar), kom-\n    panzasyon (sanayi, kamu binaları ve alışveriş merkezi gibi büyük yapılarda kullanılan enerjinin aktif güç verimliliğini artırmak için reaktif güç telafi kondan-\n    satörleri kullanılır), gerilim çoklayıcılar (alternatif gerilimi kondansatörler yardımıyla yüksek DC'ye çeviren devrelerdir).\n    • Seri bağlı sığaçların Ctpl kapasitesi, paralel dirençler gibi, en küçüğününün altındadır. 2 sığaç için Ctpl=C1*C2/(C1+C2), eşit n sığaç için Ctpl=C/n. \n    Örn.Ctpl=18uF*36uF/(18uF+36uF)=12uF. Paralel bağlantıda (seri direnç benzeri) toplam kapasite artar, erilimler ise aynı kalır. Farklı gerilim değerlerine\n    sahip kondansatörlerin paralel bağlanmasında, devre gerilimi en düşük kondansatörün gerilimi kadar olur. Ctpl=C1+C2+C3, Uc1=Uc2=Uc3. Örn.Ctpl=18uF\n    +36uF=54uF. Karışık bağlantıda seri ve paralel bağlantı bir arada kullanılır ve çözümde öncelikle paralel bağlantılar hesaplanır. Örn.Ctpl=C1 seri C2//C3=\n    18uF seri 6uF//3uF=18 seri 9=18*9/(18+9)=6uF. Örn.Ctpl=6F seri 3F=6*3/9=2F; Ctpl=6nF//6nF=6+6=12nF; Ctpl=6nF//(8nF seri 8nF)=6//4=10nF;\n    Ctpl=(4F//15F) //(3 seri 3 seri 3F)=19F//1F=20F. Sağdaki V12 devrede her 4020mS'de ilk 2000mS sığaç şarjı, 2010mS gecikmeli ikinci 2000mS sığaçın\n    LED üzerinden deşarjı gerçekleşmekte, yani LED ampül her 4020ms'de 2S süreyle yanıp sönmektedir. T=RC=330Ω*1mF=330ms, 5T=1.65 Sn yaklaşık tam\n    şarj-deşarj süresi olup, dejarjda LED akımı Iled=(Vc-Vled)/R=(11.98V-2.87V)/330Ω=27.61mA simülasyonda okunur.\n2.7 • Yalıtılmış iletken telin dairesel sarılmasıyla elde edilen devre elemanına bobin (endüktör, irkileç) denir. Bobin, elektrik enerjisini manyetik enerjiye, man-\n    yetik enerjiyi de elektrik enerjisine dönüştürebilir. “L” harfi ile gösterilir, birimi “H-enry”dir. Doğru akımda bobin DC motorlarda, rölelerde, elektromıknatıs-\n    larda, filtre ve regüle devrelerinde, anten yükselteçlerinde, TV ve radyo devrelerinde kullanılır. Bobinlerin seri ve paralel bağlantıları R direnç gibidir. Örn.\n    Seri Ltpl=L1+L2+L3=10mH+15mH+25mH=50mH. Paralel üçlü Leş=1/(1/L1+1/L2+1/L3), ikili Leş=L1*L2/(L1+L2), çoklu eşit Leş=L/n.Örn.paraler üçlü\n    Leş=1/(10e-3+1/15e-3+1/30e-3)=30e-3/(3+2+1)=5mH; ikili Leş=3mH//6mH=3*6/(3+6)=2mH; beşli Leş=60mH//60mH//40mH+40mH=120mH/(2+\n    2+2+3+3)=120/12=10mH. Örn.Karışık Leş=L1+L2//L3=30mH+30mH//30mH=30+15=45mH. Örn.Leş=5+10=15mH; Leş=4//4=2mH; Leş=(12//12)//\n    (8+2+2)=6//12=4mH; Leş=8//(4+4)=4mH.
TEXT 2000 48 Left 2 !;tran 0 1200mS 1S startup
TEXT 2032 128 Left 2 !K L1 L2 1
TEXT 3048 112 Left 2 ;Ampül
TEXT 2128 512 Left 2 ;Ampül
TEXT 2504 464 Left 2 ;üçgenden yıldıza
TEXT 2552 600 Left 2 ;Ra
TEXT 2656 688 Left 2 ;Rb
TEXT 2648 504 Left 2 ;Rc
TEXT 2016 2320 Left 2 !.model vd sw (Vt=500mV Vh=-250mV Ron=10m Roff=100meg)
TEXT 1984 1888 Left 2 !.tran 0 15S 1S startup
TEXT 3784 1096 Left 2 ;Ra
TEXT 3808 736 Left 2 ;A
TEXT 3576 1096 Left 2 ;B
TEXT 4032 1096 Left 2 ;C
TEXT 3912 904 Left 2 ;Rb
TEXT 3680 904 Left 2 ;Rc
TEXT 3808 888 Left 2 ;R1
TEXT 3736 1016 Left 2 ;R2
TEXT 3872 1008 Left 2 ;R3
TEXT 3928 728 Left 2 ;Dirençler eşitse Rd=3*Ry\nVeya delta-->yıldız Ry=Rd/3
TEXT 3952 808 Left 2 ;Y-->D için Rpay=R1*R2+R1*R3+R2*R3\nRa=Rpay/R1, Rb=Rpay/R2, Rc=Rpay/R3
TEXT 4032 920 Left 2 ;D-->Y için Rpayda=Ra+Rb+Rc\nR1=Rb*Rc/Rpayda, R2=Ra*Rc/Rpayda, R3=Ra*Rb/Rpayda
TEXT 3400 592 Left 2 ;I=34.89mA
TEXT 2640 712 Left 2 ;I=34.89mA
TEXT 2128 1200 Left 2 ;Yıldız-->Delta
TEXT 2776 976 Left 2 ;7.5
TEXT 2848 1152 Left 2 ;4.5
TEXT 2824 1040 Left 2 ;12
TEXT 3184 1136 Left 2 ;I=1.5A
TEXT 2504 1048 Left 2 ;I=1.5A
TEXT 1944 1048 Left 2 ;I=1.5A
TEXT 2136 1368 Left 2 ;Delta-->Yıldız
TEXT 2640 1552 Left 2 ;20
TEXT 2688 1576 Left 2 ;15
TEXT 2656 1648 Left 2 ;8.57
TEXT 2952 1680 Left 2 ;I=686.3mA
TEXT 2432 1648 Left 2 ;I=686.3mA
TEXT 1928 1640 Left 2 ;I=686.3mA
RECTANGLE Normal 2704 768 2496 448 2
RECTANGLE Normal 2368 1232 2032 976 2
RECTANGLE Normal 2400 1344 2064 1584 2
CIRCLE Normal 3136 224 3024 112 2
CIRCLE Normal 2224 624 2112 512 2

The netlist it stands for:
* EBA092.asc
V1 N003 0 SINE(0 230V 50Hz)
L1 N003 0 1H Rser=10Ω
L2 0 N004 2.87mH
D1 N002 N004 1N5817
D2 N004 N005 1N5817
D3 N002 0 1N5817
D4 0 N005 1N5817
C1 N002 N005 1mF
R1 N002 N005 1kΩ
V2 N001 0 9V Rser=1u
V3 N001 0 9V Rser=1u
V4 N001 0 9V Rser=1u
V5 N001 0 9V Rser=1u
R2 N001 0 1kΩ
V6 N006 N013 9V Rser=1u
V7 N006 N014 9V Rser=1u
V8 N013 0 9V Rser=1u
V9 N014 0 9V Rser=1u
R3 N006 0 1kΩ
R4 N011 N015 600
R5 N016 N015 40
R6 N016 N011 100
R7 0 N011 600
R8 0 N016 400
V10 N015 0 10V
V11 N007 0 10V
V12 N034 0 12V
R10 N035 N034 330Ω
C2 N038 0 1mF
R11 N033 N032 330Ω
D5 N033 0 AOT-2015
S1 N032 N038 N037 0 vd
V13 N037 0 PULSE(0 1V 2010mS 1nS 1nS 2000mS 4020mS)
S2 N038 N035 N036 0 vd
V14 N036 0 PULSE(0 1V 0S 1nS 1nS 2000mS 4020mS)
V15 N025 0 10V
R12 N025 N026 12
R13 N027 N025 18
R14 N027 N026 6
R15 0 N026 18
R16 N027 0 12
V16 N024 0 10V
R17 N024 N030 6
R18 N030 N029 2
R19 N031 N030 3
R20 0 N029 18
R21 N031 0 12
V17 N017 0 10V
R22 N023 N017 5
R23 N018 N023 15
R24 N018 N017 10
R25 0 N023 7.5
R9 N008 N007 600
R30 N009 N008 54.55
R31 N012 N007 40
R32 N009 N012 36.36
R33 0 N009 218.18
V19 N010 0 10V
R35 0 N010 286.56
V20 N019 0 10V
R37 N020 N019 10
R39 N020 0 5
R40 N018 0 5
R34 N020 N019 30
R36 N019 0 15
R38 N020 0 45
V21 N022 0 10V
R42 N022 0 6.67
V22 N028 0 10V
R41 N028 0 14.57
.model D D
.lib standard.dio
* EBA092.asc: Doğru akımın esasları, direnç, sığaç ve bobin devreleri-2 örneği.
* 2.1 • Doğru akım elektronik devrelerde kullanılır. Hassas olan bu devreler akımdaki değişikliğe karşı duyarlıdır. Devrelerin tasarımlarına göre çalışa-
*     bilmesi, standartlara uygun doğru akım ile mümkündür. Doğru akım “DA” olarak veya İngilizce “DC” (Direct Current) olarak kısaltılır. " I " veya
*     " i " harfleryile gösterilir. Birimi amper (A)’dir. Zamana bağlı olarak yönü değişmeyen akıma doğru akım denir. Doğru akımın yönü değişmese de
*     şiddeti değişebilir. İki çeşit doğru akım vardır:  Düzgün doğru akım (zamana göre yönü ve şiddeti değişmez), değişken doğru akım (zamana göre
*     yönü değişmez ancak şiddeti değişir). Doğru akımın kullanıldığı yerler: DC elektrik motorlarında, elektromıknatıslarda, elektrikli taşıtlarda (metro,
*     tren, tramvay), elektronik cihazların çoğunda (tv, bilgisayar, cep tel, vb), haberleşme cihazlarında (telekomünikasyon), redresörlü kaynak maki-
*     nelerinde, maden arıtma (elektroliz) ve maden kaplamacılığında (galvonoteknik), yüksek gerilim doğru akım (HVDC- HighVoltageDirectCurrent)
*     sistemleri ile denizaltı enerji iletimlerinde kullanılır.
* 2.2 • DC kaynaklar: pil ve batarya, akü, güneş pili, dinamo, doğrultaç devresi. Kimyasal olay sonucu elektrik enerjisi açığa çıkaran ve depo eden
*     cihazlara pil denir; taşınabilir güç kaynaklarıdır. Aynı ölçekli pillerin seri veya paralel bağlanarak bir kutu içerisinde biraraya getirilmesiyle oluşan
*     pil grubuna batarya denir; daha yüksek gerilim ve kapasite isteyen cihazlarda kullanılır. Pil veya bataryanın bir saatte verebileceği enerji miktarına
*     kapasite denir; Ah (Amper saat) veya mAh (miliamper saat) ile ifade edilir. Örn.2200mAh pille 10mA cihaz 220 saat, 100mA cihaz 22 saat çalışır.
*     Piller 2 gruptur: şarj edilmeyen (çinko karbon, alkali, lityum, düğme yada para pil), şarj edilen (nikel kadmiyum, nikel metal hidrit, lityum iyon, lityum
*     polimer, lityum demir fosfat).
*     • Elektrik enerjisini kimyasal enerji olarak depo eden ve gerektiğinde elektrik enerjisi olarak veren cihazlara akümülatör (akü) denir; sulu ve kuru
*     tiplidir. Örn.200Ah akü 5A çıktıyı 40S besler. Güneş enerjisi yenilenebilir ve herhangi bir gaz salınımı yapmayan temiz enerji türüdür. Güneşten gelen
*     ve enerji taşıyan fotonlar güneş panelinin üzerinde toplanır. Paneli oluşturan güneş pilleri (fotovoltaik piller) fotondan aldığı enerjiyi DC elektrik
*     enerjisine dönüştürür ve aküde depolanır. Dinamo, mıknatıs statör içinde bobin rotor dönüşü, endüksiiyon, komütatör ve fırçayla DC elektrik ener-
*     jisi üretir; enerji depolanmaz. Doğrultaçlar alternatif akımı doğru akıma dönüştüren elektronik devrelerdir. Sağdaki V1=230VAC 50Hz, dönüştüreç
*     ve 4'lü doğrultaç diyotla 12VDC'ye hafif kıpırtıyla (11.64-->11.73mA) cihazı besler.
*     • Doğru akım kaynakları seri, paralel veya karışık bağlantı yapılarak istenilen büyüklükte gerilimler elde edilir. Seri bağlantıda aynı kutupluysa top-
*     lanır. Örn.Etpl=E1+E2+E3=1.5V+1V+4.5V=7V. Örn.E=+4.5-6+1.5=0V. Paralel bağlanacak doğru akım kaynaklarının gerilimleri eşit olmak zorun-
*     dadır, yoksa kaynaklar zarar görür. Amaç cihazın kapasitesini artırmak, daha uzun zaman çalışmasını sağlamaktır. Etpl=E1=E2=E3, Itpl=I1+I2+I3.
*     Örn.Sağdaki V2 devrede Vtpl=9V, Iamp=9V/1k=9mA, Iv2=9mA/4=2.25mA okur. Seri ve paralel karışık bağlantıdaki amaç ihtiyaç olan kapasiteli
*     gerilim ve akımı elde etmektir. Karışık bağlantı şekli genellikle bataryalarda kullanılır. Örn. Sağdaki V6 devrede Vtpl=V6+V7=9+9=18V, Itpl=18V
*     /1k=18mA=Iamp, I1=I2=Iamp/2=9mA okur. Dikkat edilecek hususlar: Paralel bağlanacak kaynakların gerilim değerleri eşit olmalıdır. Yüksek bir
*     gerilim elde etmek için kaynaklar seri bağlanır. Kaynaklar uzun süre enerji verebilmesi için paralel bağlanır. Kaynak uçları kısadevre yapılmamalıdır.
* 2.3 • Doğru akım devre bağlantılarında direnç olarak isimlendirilen elemanlar lamba, ısıtıcı, DC motor gibi alıcılar olarak düşünülmelidir. Elektrik ener-
*     jisi ile çalışan tüm cihaz ve elemanlar dirence sahiptir. Ortak ifade şekli olarak tamamı için direnç ifadesi kullanılır. Seri devrede her direnç üzerinden
*     aynı akım geçer. Örn.Rtpl=R1+R2+R3=10+5+15=30Ω. Örn.Rtpl=200+2k+3k+300=5.5kΩ. Seride tek direnç bozulursa devre açıkdevre olur; para-
*     lelde ise sadece o kol çalışmaz, diğerleri devreyi tamamlar. Paralelde Reş=1/(1/R1+1/R2)=R1*R2/(R1+R2), dirençler eşitse Reş=R/n olur. Örn. 2
*     dirençle Reş=6*12/(6+12)=72/18=4Ω. Örn.3 eşit direnç Reş=300/3=100Ω. Orn.3 paralel 10k//10k//20k ise ikisi=10k*10k/(10k+10k)=5k, son
*     ikisi=5k*20k/(5k+20k)=4kΩ. Örn.Reş=150Ω olan 5 eşit direncin herbiri=5*150=750Ω'dur. Karışık devrelerde seri ve paralel bağlantın birlikte bulu-
*     nur. Örn.Reş=R1+R2//R3=18+18//18=18+9=27Ω. Örn.Reş=(4+6)//40=10//40=10*40/(10+40)=8Ω. Örn.Reş=100=(100+200)//R//(150+150)
*     ise 100=300//R//300=150//R, 100*150+100*R=150*R, R=15000/50=300Ω. Örn.Reş=4+10//(8+6//3)+12//12=4+10//(8+2)+6=4+5+6=16Ω.
*     • Toplam direnci bulmak için yıldız-üçgen yada üçgen-yıldız dönüşümleri yapılarak devre sadeleştirilir. Yıldız (saat tersi) R1, R2, R3 dirençler ABC
*     üçgen Ra, Rb, Rc dönüşüm için Rpay=R1*R2+R1*R3+R2*R3, Ra=Rpay/R1, Rb=Rpay/R2, Rc=Rpay/R3 (dirençler artar). Örn.yıldız R1=4, R2=8, R3=
*     4Ω ise Rp=4*8+4*4+8*4=80Ω, üçgen Ra=80/4=20Ω, Rb=80/8=10Ω, Rc=80/4=20Ω. Üçgen-yıldız dönüşümünde Rpayda=Ra+Rb+Rc, R1=Rb*Rc/
*     Rpd, R2=Ra*Rc/Rpd, R3=Ra*Rb/Rpd (dirençler azalır). Örn.üçgen Ra=20, Rb=10, Rc=20Ω ise Rpd=20+10+20=50Ω ve yıldız R1=10*20/50=4, R2=
*     20*20/50=8, R3=20*10/50=4Ω. Sağdaki V10 (34.89mA) D--Y, V17 (1.5A) Y-->D ve V15 (686.3mA) D-->Y devreleri inceleyin.
* 2.4 • Bir elektrik devresinde akım, gerilim ve direnç arasındaki ilişkiyi açıklayan kanuna Ohm (Ω) Kanunu denir. Ohm üçgeni U/I-R olup, U=I*R, I=U/R,
*     R=U/I. Örn.I=15V/5Ω=3A. Örn.U=2A*10Ω=20V. Örn.R=12V/2A=6Ω. Örn.Reş=5+10//10=10Ω, I=20V/10Ω=2A. Örn.Reş=24V/4A=6Ω ise (6+6)//
*     Rx=6Ω ise 6=12*Rx/(12+Rx), Rx=72/6=12Ω. Örn.Reş=(6+0)//(6//6)+8//8=2+4=6Ω, I=30V/6Ω=5A. Örn.U=12V, kırmızı LED Vled=1.5V, azami I=
*     20mA ise Vr=12V-1.5V=10.5V, R=10.5V/20mA=525Ω (>enyakını 560Ω) olmalıdır.
* 2.5 • Kirşof'un gerilimler kanununa göre seri bir devreye uygulanan gerilim, dirençler (yükler, alıcılar) üzerine düşen gerilimlerin toplamına eşittir ve hepsi-
*     nin  üzerinden aynı akım geçer. U=Ur1+Ur2+Ur3, Ur1=I*R1, Ur2=I*R2, Ur3=I*R2. Örn.24V=I*(3Ω+5Ω+4Ω), I=24/12=2A, Vr1=2A*3Ω=6V, Vr2=2*5
*     =10V, Vr3=2*4=8V, Vtpl=6V+10V+8V=24V. Örn.I=30V/(7+3+5Ω)=2A, Vtpl=2*7+2*3+2*5=14+6+10=30V. Örn. Vr1=6V=I*2Ω, I=6/2=3A, Vtpl=
*     3A*2Ω+3*6+3*3=6V+18V+9V=33V. Paralel bağlı dirençlerin üzerinden geçen akımların toplamı devre akımına eşittir; dirençlerden geçen akım farklı
*     iken üzerlerine düşen gerilimler aynıdır. I=Ir1+Ir2+Ir3, Ir1=U/R1, Ir2=U/R2, Ir3=U/R3. Örn.Ir1=30V/15Ω=2A, Ir2=30/10=3A, Ir2=30/5=6A, Itpl=
*     2+3+6=11A, Reş=U/I=30V/11A=2.73Ω=1/(1/15+1/10+1/5). Örn.Karışık devre Ir1=60V/20Ω=3A, Ir2r3=60V/(10Ω+20Ω)=2A, Itpl=3+2=5A, Ur1=
*     60V, Ur2=2*10=20V, Ur3=2*20=40V. Örn.Reş=2kΩ+6kΩ//3kΩ=2k+2k=4k, I=12V/4kΩ=3mA, Ur1=3mA*2kΩ=6V==Ur2r3, Ir2=6V/6kΩ=1mA, Ir3=
*     6/3k=2mA. Örn.Reş=1Ω+40//((8//8)+6)=1+40//(4+6)=1+40//10=1+8=9Ω, I=45V/9Ω=5A, Ur1=5A*1Ω=5V, U2=45-5=40Ω, Ir2=40V/40Ω=1A,
*     Ir2eş=5-1=4A, Ir3=Ir4=2A, Ir5=4A.
*     • Dirençli devrelerin seri-paralel yada yıldız-üçgen kurallarına göre çözülemeyen ve gözlü devreler olarak isimlendirilen devrelerdir. Gözlü devreler iki
*     veya daha fazla göze sahip olan devrelerdir. Çevre akımları yönteminde Kirşof’un gerilimler kanunu uygulanır. Her gözde bulunan elemanların üzerine
*     düşen gerilimlerin toplamı, o göze ait kaynak gerilimine eşit olmalıdır. Kol akımları her gözde aynı yönlü (-+ yada +-) olmalıdır: U1=I1*(R1+R3)+I2*R3,
*     U2=I1*R3+I2*(R2+R3); U2 tersse U1=I1*(R1+R3)-I2*R3, U2=-I1*R3+I2*(R2+R3). Örn.19V=I1*(2Ω+3Ω)+I2*3Ω, 33V=I1*3Ω+I2*(6Ω+3Ω), 19=5I1+
*     3I2, 33=3I1+9I2, -24=-12I1, I1=2A, I2=27/9=3A, Ir3=I1+I2=2+3=5A. Örn.U2 tersse, 22V=I1*(3Ω+2Ω)-I2*2Ω, 12V=-I1*2Ω+I2*(4Ω+2Ω), 22=5I1-2I2,
*     12=-2I1+6I2, 78=13I1, I1=6A, I2=4A, I3=I1-I2=6-4=2A, Ur1=I1*3Ω=18V, Ur2=I2*4=16V, Ur3=2*(I1-I2)=4V, U1=Ur1+Ur3=18+4=22V, U2=16-4=12V.
*     • Düğüm gerilimleri yönteminde Kirşof’un akımlar kanunu (ir düğüm noktasına gelen akımların toplamı giden akımların toplamına eşittir) uygulanır. A
*     orta nokta için I1+I2=I3, (U1-Va)/R1 + (U2-Va)/R2 = Va/R3. Örn.(45V-Va)/6Ω+(51V-Va)/10Ω=Va/3Ω, 5*(45-Va)+3*(51-Va)=10Va, Va=378/18=21V,
*     I1=(45V-21V)/6Ω=4A, I2=(51V-21V)/10Ω=3A, I3=21V/3Ω=7A=4A+3A, Ur1=I1*R1=4*6=24V, Ur2=3*10=30V, Ur3=7*3=21V, U1=24+21=45V, U2=30+
*     21=51V. Örn.(40-Va)/8+(50-Va)/6=Va/8, 3(40-Va)+4(50-Va)=3Va, Va=320/10=32V, I1=1A, I2=3A, I3=4A.
* 2.6 • Elektrik enerjisini elektrik yükü olarak depolayan devre elemanlarına kondansatör denir. Kondansatör iki iletken levha arasında bir yalıtkan (dielek-
*     trik) madde bulundurup elektrik enerjisi iletken levhalar üzerinde depolar. Kondansatörün enerjiyi depo edebilme özelliğine kapasite C denir, birimi F-
*     arad'dır: 1F=1e3mF=1e6uF=1e9nF=1e12pF. Örn.360uF=360e-3mF=0.36mF, 68uF=68e3nF, 2.1nF=2.1e3pF=2.1e-9F. Kondansatörün şarj deşarj (5T)
*     sürelerini bulmak için zaman sabiti T hesaplanmalıdır. T=RC, sn=Ω*F. 1T=0.632 (şarj-deşarj). Şarj Vc=U*(1-e**(-t/RC), deşarj Vc=U*exp(-t/RC). exp(-5)=
*     0.00674=%0.67, 1-exp(-1)=0.632=%63.2.  Kondansatörler elektronik devrelerde 4 ana amaçla kullanılır: elektrik enerjisini depolar, filtreleme (kuplaj–
*     dekuplaj, kondansatörler DC akıma karşı şarj sonrası açık devre olduğundan gürültü/parazit engelleme ve frekans ayar işlemlerinde kullanılırlar), kom-
*     panzasyon (sanayi, kamu binaları ve alışveriş merkezi gibi büyük yapılarda kullanılan enerjinin aktif güç verimliliğini artırmak için reaktif güç telafi kondan-
*     satörleri kullanılır), gerilim çoklayıcılar (alternatif gerilimi kondansatörler yardımıyla yüksek DC'ye çeviren devrelerdir).
*     • Seri bağlı sığaçların Ctpl kapasitesi, paralel dirençler gibi, en küçüğününün altındadır. 2 sığaç için Ctpl=C1*C2/(C1+C2), eşit n sığaç için Ctpl=C/n.
*     Örn.Ctpl=18uF*36uF/(18uF+36uF)=12uF. Paralel bağlantıda (seri direnç benzeri) toplam kapasite artar, erilimler ise aynı kalır. Farklı gerilim değerlerine
*     sahip kondansatörlerin paralel bağlanmasında, devre gerilimi en düşük kondansatörün gerilimi kadar olur. Ctpl=C1+C2+C3, Uc1=Uc2=Uc3. Örn.Ctpl=18uF
*     +36uF=54uF. Karışık bağlantıda seri ve paralel bağlantı bir arada kullanılır ve çözümde öncelikle paralel bağlantılar hesaplanır. Örn.Ctpl=C1 seri C2//C3=
*     18uF seri 6uF//3uF=18 seri 9=18*9/(18+9)=6uF. Örn.Ctpl=6F seri 3F=6*3/9=2F; Ctpl=6nF//6nF=6+6=12nF; Ctpl=6nF//(8nF seri 8nF)=6//4=10nF;
*     Ctpl=(4F//15F) //(3 seri 3 seri 3F)=19F//1F=20F. Sağdaki V12 devrede her 4020mS'de ilk 2000mS sığaç şarjı, 2010mS gecikmeli ikinci 2000mS sığaçın
*     LED üzerinden deşarjı gerçekleşmekte, yani LED ampül her 4020ms'de 2S süreyle yanıp sönmektedir. T=RC=330Ω*1mF=330ms, 5T=1.65 Sn yaklaşık tam
*     şarj-deşarj süresi olup, dejarjda LED akımı Iled=(Vc-Vled)/R=(11.98V-2.87V)/330Ω=27.61mA simülasyonda okunur.
* 2.7 • Yalıtılmış iletken telin dairesel sarılmasıyla elde edilen devre elemanına bobin (endüktör, irkileç) denir. Bobin, elektrik enerjisini manyetik enerjiye, man-
*     yetik enerjiyi de elektrik enerjisine dönüştürebilir. “L” harfi ile gösterilir, birimi “H-enry”dir. Doğru akımda bobin DC motorlarda, rölelerde, elektromıknatıs-
*     larda, filtre ve regüle devrelerinde, anten yükselteçlerinde, TV ve radyo devrelerinde kullanılır. Bobinlerin seri ve paralel bağlantıları R direnç gibidir. Örn.
*     Seri Ltpl=L1+L2+L3=10mH+15mH+25mH=50mH. Paralel üçlü Leş=1/(1/L1+1/L2+1/L3), ikili Leş=L1*L2/(L1+L2), çoklu eşit Leş=L/n.Örn.paraler üçlü
*     Leş=1/(10e-3+1/15e-3+1/30e-3)=30e-3/(3+2+1)=5mH; ikili Leş=3mH//6mH=3*6/(3+6)=2mH; beşli Leş=60mH//60mH//40mH+40mH=120mH/(2+
*     2+2+3+3)=120/12=10mH. Örn.Karışık Leş=L1+L2//L3=30mH+30mH//30mH=30+15=45mH. Örn.Leş=5+10=15mH; Leş=4//4=2mH; Leş=(12//12)//
*     (8+2+2)=6//12=4mH; Leş=8//(4+4)=4mH.
;tran 0 1200mS 1S startup
K L1 L2 1
* Ampül
* Ampül
* üçgenden yıldıza
* Ra
* Rb
* Rc
.model vd sw (Vt=500mV Vh=-250mV Ron=10m Roff=100meg)
.tran 0 15S 1S startup
* Ra
* A
* B
* C
* Rb
* Rc
* R1
* R2
* R3
* Dirençler eşitse Rd=3*Ry
* Veya delta-->yıldız Ry=Rd/3
* Y-->D için Rpay=R1*R2+R1*R3+R2*R3
* Ra=Rpay/R1, Rb=Rpay/R2, Rc=Rpay/R3
* D-->Y için Rpayda=Ra+Rb+Rc
* R1=Rb*Rc/Rpayda, R2=Ra*Rc/Rpayda, R3=Ra*Rb/Rpayda
* I=34.89mA
* I=34.89mA
* Yıldız-->Delta
* 7.5
* 4.5
* 12
* I=1.5A
* I=1.5A
* I=1.5A
* Delta-->Yıldız
* 20
* 15
* 8.57
* I=686.3mA
* I=686.3mA
* I=686.3mA
.backanno
.end